# EAGLE design hauptplatine_prot (EAGLE 5.10)
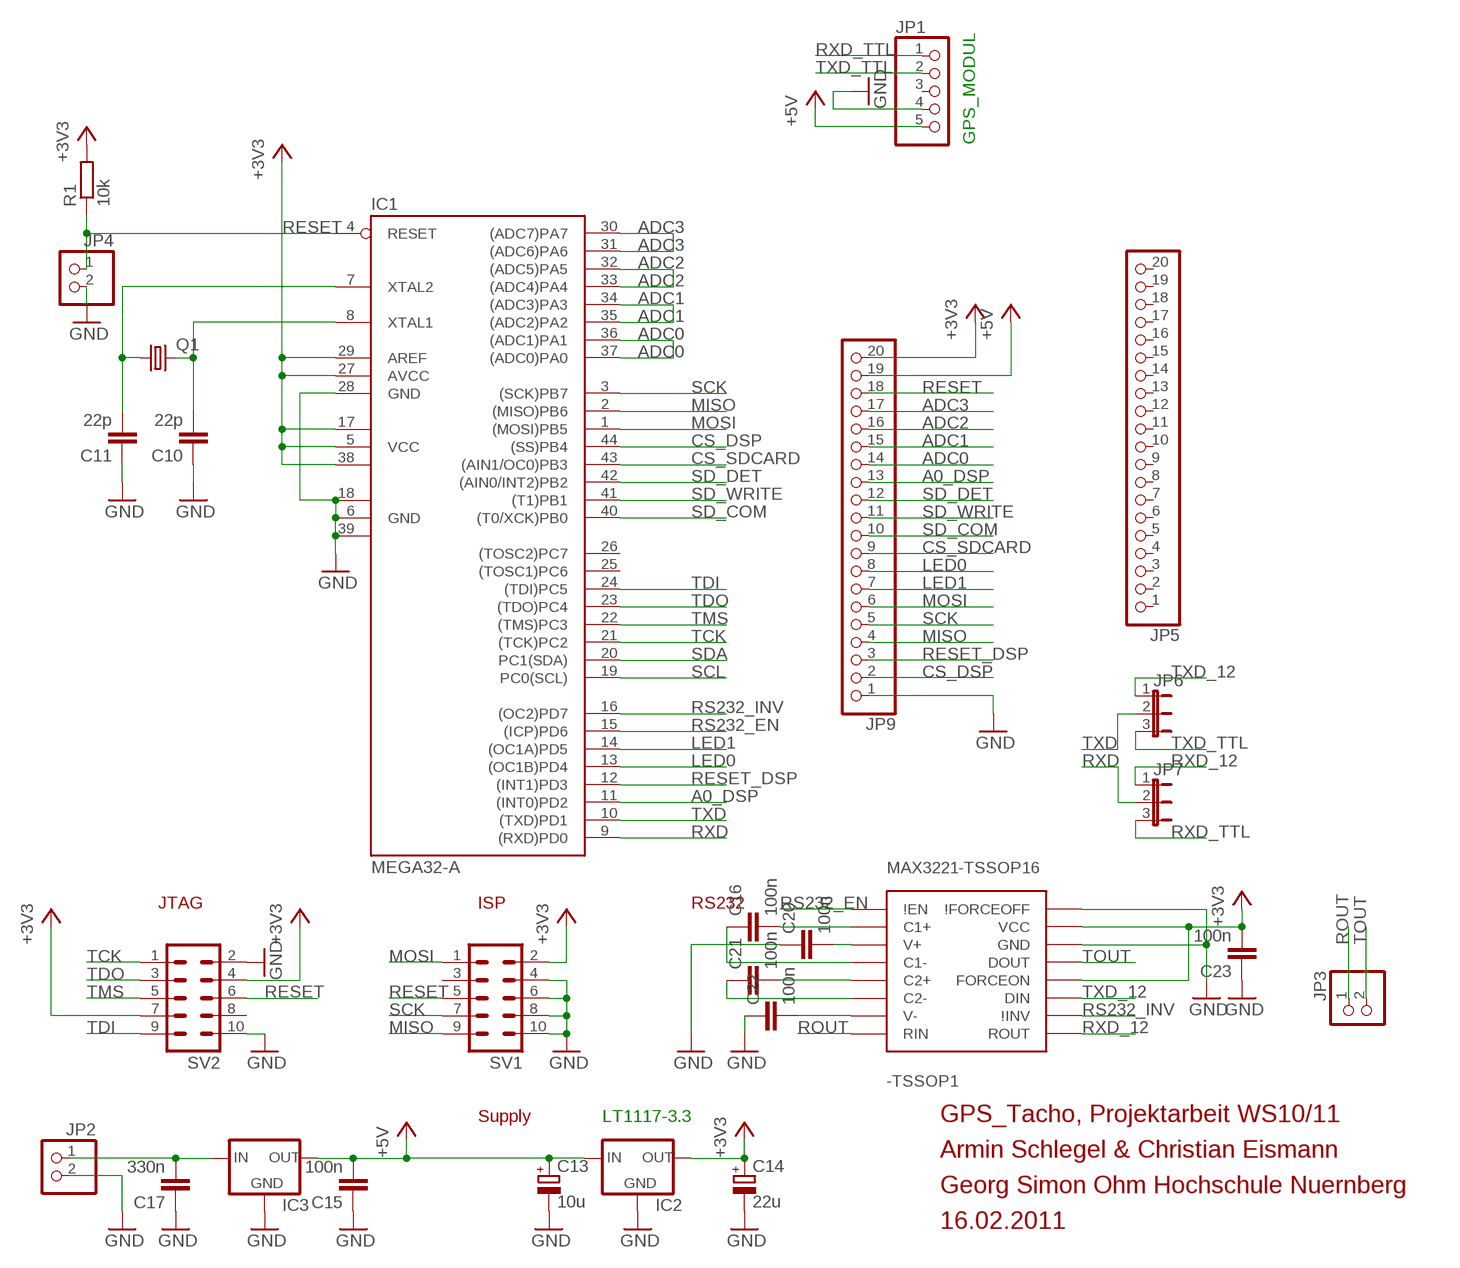
[diagram p0: schematic, sheet 1]

## Parts
-TSSOP1  MAX3221-TSSOP16  [TSSOP16]
C10  22p  C-EUC0805  [C0805]
C11  22p  C-EUC0805  [C0805]
C13  10u  CPOL-EUE1.8-4  [E1,8-4]
C14  22u  CPOL-EUE2.5-6  [E2,5-6]
C15  100n  C-EUC0805  [C0805]
C16  100n  C-EUC0805K  [C0805K]
C17  330n  C-EUC0805  [C0805]
C20  100n  C-EUC0805K  [C0805K]
C21  100n  C-EUC0805K  [C0805K]
C22  100n  C-EUC0805K  [C0805K]
C23  100n  C-EUC0805K  [C0805K]
IC1  MEGA32-A  [TQFP44]
IC2  LM1117  [SOT223]
IC3  78XXS  [78XXS]
JP1  PINHD-1X5_2.54-90°  [1X05/90]
JP2  PINHD-1X2/90  [1X02/90]
JP3  PINHD-1X2/90  [1X02/90]
JP4  PINHD-1X2/90  [1X02/90]
JP5  PINHD-1X20  [1X20]
JP6  JP2E  [JP2]
JP7  JP2E  [JP2]
JP9  PINHD-1X20  [1X20]
Q1  CRYSTALHC49UP  [HC49UP]
R1  10k  R-EU_R0805  [R0805]
SV1  ML10L  [ML10L]
SV2  ML10L  [ML10L]

## Nets
+3V3: -TSSOP1.12(FORCEON) -TSSOP1.15(VCC) C14.+ C23.2 IC1.5(VCC) IC1.17(VCC1) IC1.27(AVCC) IC1.29(AREF) IC1.38(VCC2) IC2.2(OUT) JP9.20 R1.2 SV1.2 SV2.4 SV2.7
+5V: C13.+ C15.2 IC2.3(IN) IC3.OUT JP1.5 JP9.19
A0_DSP: IC1.11((INT0)PD2) JP9.13
ADC0: IC1.36((ADC1)PA1) IC1.37((ADC0)PA0) JP9.14
ADC1: IC1.34((ADC3)PA3) IC1.35((ADC2)PA2) JP9.15
ADC2: IC1.32((ADC5)PA5) IC1.33((ADC4)PA4) JP9.16
ADC3: IC1.30((ADC7)PA7) IC1.31((ADC6)PA6) JP9.17
CS_DSP: IC1.44((SS)PB4) JP9.2
CS_SDCARD: IC1.43((AIN1/OC0)PB3) JP9.9
GND: -TSSOP1.14(GND) -TSSOP1.16(\!FORCEOFF) C10.1 C11.1 C13.- C14.- C15.1 C17.1 C20.1 C22.1 C23.1 IC1.6(GND) IC1.18(GND1) IC1.28(GND) IC1.39(GND2) IC2.1(GND) IC3.GND JP1.4 JP2.2 JP4.2 JP9.1 SV1.4 SV1.6 SV1.8 SV1.10 SV2.2 SV2.10
LED0: IC1.13((OC1B)PD4) JP9.8
LED1: IC1.14((OC1A)PD5) JP9.7
MISO: IC1.2((MISO)PB6) JP9.4 SV1.9
MOSI: IC1.1((MOSI)PB5) JP9.6 SV1.1
N$2: C10.2 IC1.8(XTAL1) Q1.2
N$15: C11.2 IC1.7(XTAL2) Q1.1
N$19: -TSSOP1.7(V-) C22.2
N$20: C17.2 IC3.IN JP2.1
N$21: -TSSOP1.3(V+) C20.2
N$23: -TSSOP1.2(C1+) C16.2
N$24: -TSSOP1.4(C1-) C16.1
N$25: -TSSOP1.5(C2+) C21.2
N$26: -TSSOP1.6(C2-) C21.1
RESET: IC1.4(RESET) JP4.1 JP9.18 R1.1 SV1.5 SV2.6
RESET_DSP: IC1.12((INT1)PD3) JP9.3
ROUT: -TSSOP1.8(RIN) JP3.1
RS232_EN: -TSSOP1.1(\!EN) IC1.15((ICP)PD6)
RS232_INV: -TSSOP1.10(\!INV) IC1.16((OC2)PD7)
RXD: IC1.9((RXD)PD0) JP7.2
RXD_12: -TSSOP1.9(ROUT) JP7.1
RXD_TTL: JP1.1 JP7.3
SCK: IC1.3((SCK)PB7) JP9.5 SV1.7
SCL: IC1.19(PC0(SCL))
SD_COM: IC1.40((T0/XCK)PB0) JP9.10
SD_DET: IC1.42((AIN0/INT2)PB2) JP9.12
SD_WRITE: IC1.41((T1)PB1) JP9.11
SDA: IC1.20(PC1(SDA))
TCK: IC1.21((TCK)PC2) SV2.1
TDI: IC1.24((TDI)PC5) SV2.9
TDO: IC1.23((TDO)PC4) SV2.3
TMS: IC1.22((TMS)PC3) SV2.5
TOUT: -TSSOP1.13(DOUT) JP3.2
TXD: IC1.10((TXD)PD1) JP6.2
TXD_12: -TSSOP1.11(DIN) JP6.1
TXD_TTL: JP1.2 JP6.3
Unconnected: IC1.25((TOSC1)PC6) IC1.26((TOSC2)PC7) JP1.3 JP5.1 JP5.2 JP5.3 JP5.4 JP5.5 JP5.6 JP5.7 JP5.8 JP5.9 JP5.10 JP5.11 JP5.12 JP5.13 JP5.14 JP5.15 JP5.16 JP5.17 JP5.18 JP5.19 JP5.20 SV1.3 SV2.8

## Notes on the sheet
- GPS_MODUL
- JTAG | ISP | RS232
- Supply | LT1117-3.3 | GPS_Tacho, Projektarbeit WS10/11
- Armin Schlegel & Christian Eismann
- Georg Simon Ohm Hochschule Nuernberg
- 16.02.2011

## Library data of the parts
-TSSOP1 = texas-msp:MAX3221
C10 C11 C15-C17 C20-C23 = rcl:C-EU: CAPACITOR, European symbol
C13 C14 = rcl:CPOL-EU: POLARIZED CAPACITOR, European symbol
IC1 = atmel:MEGA32: MICROCONTROLLER 32 Kbytes FLASH 2 Kbytes SRAM 1 Kbytes EEPROM USART 8-channel 10 bit ADC Source: www.atmel.com .. doc2503.pdf
IC2 = v-reg-2:LM1117
IC3 = v-reg:78XXS: VOLTAGE REGULATOR
JP1 = pinhead:PINHD-1X5: PIN HEADER
JP2-JP4 = pinhead:PINHD-1X2: PIN HEADER
JP5 JP9 = pinhead:PINHD-1X20: PIN HEADER
JP6 JP7 = jumper:JP2E: JUMPER
Q1 = crystal:CRYSTAL: CRYSTAL
R1 = rcl:R-EU_: RESISTOR, European symbol
SV1 SV2 = con-harting-ml:ML10: HARTING

## Board
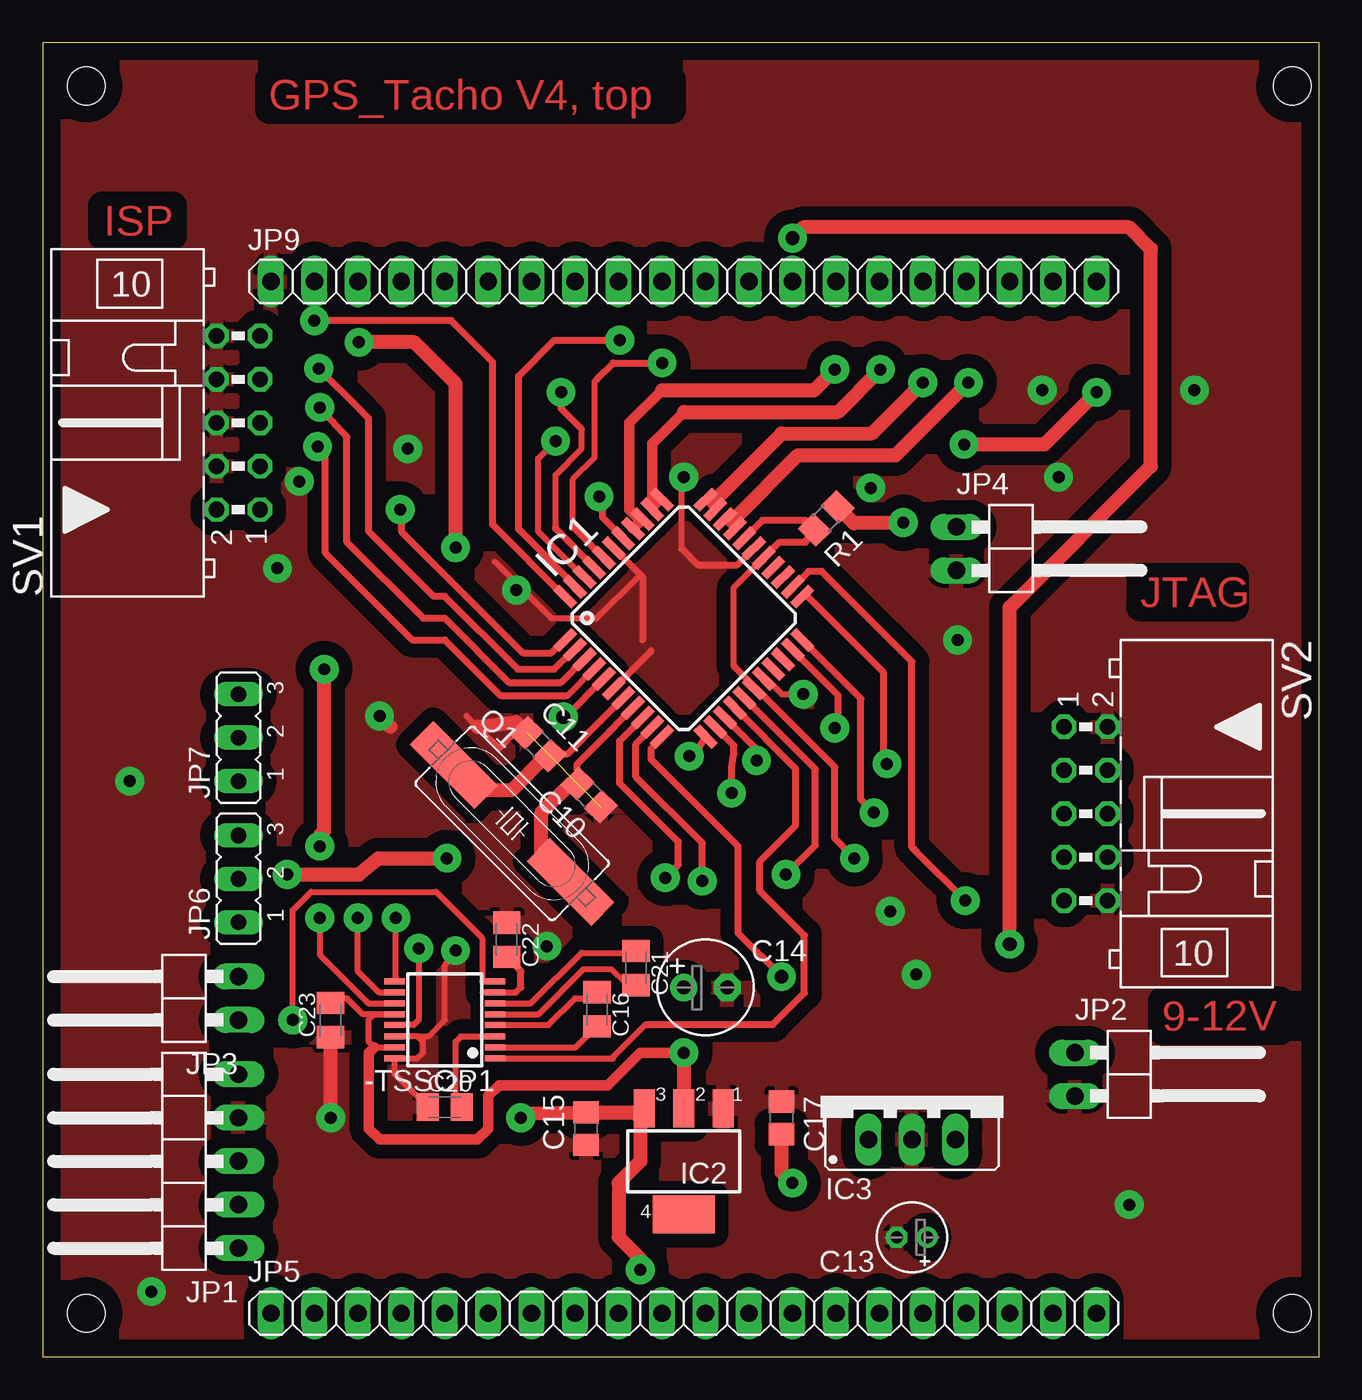
[diagram p1: board, top side]
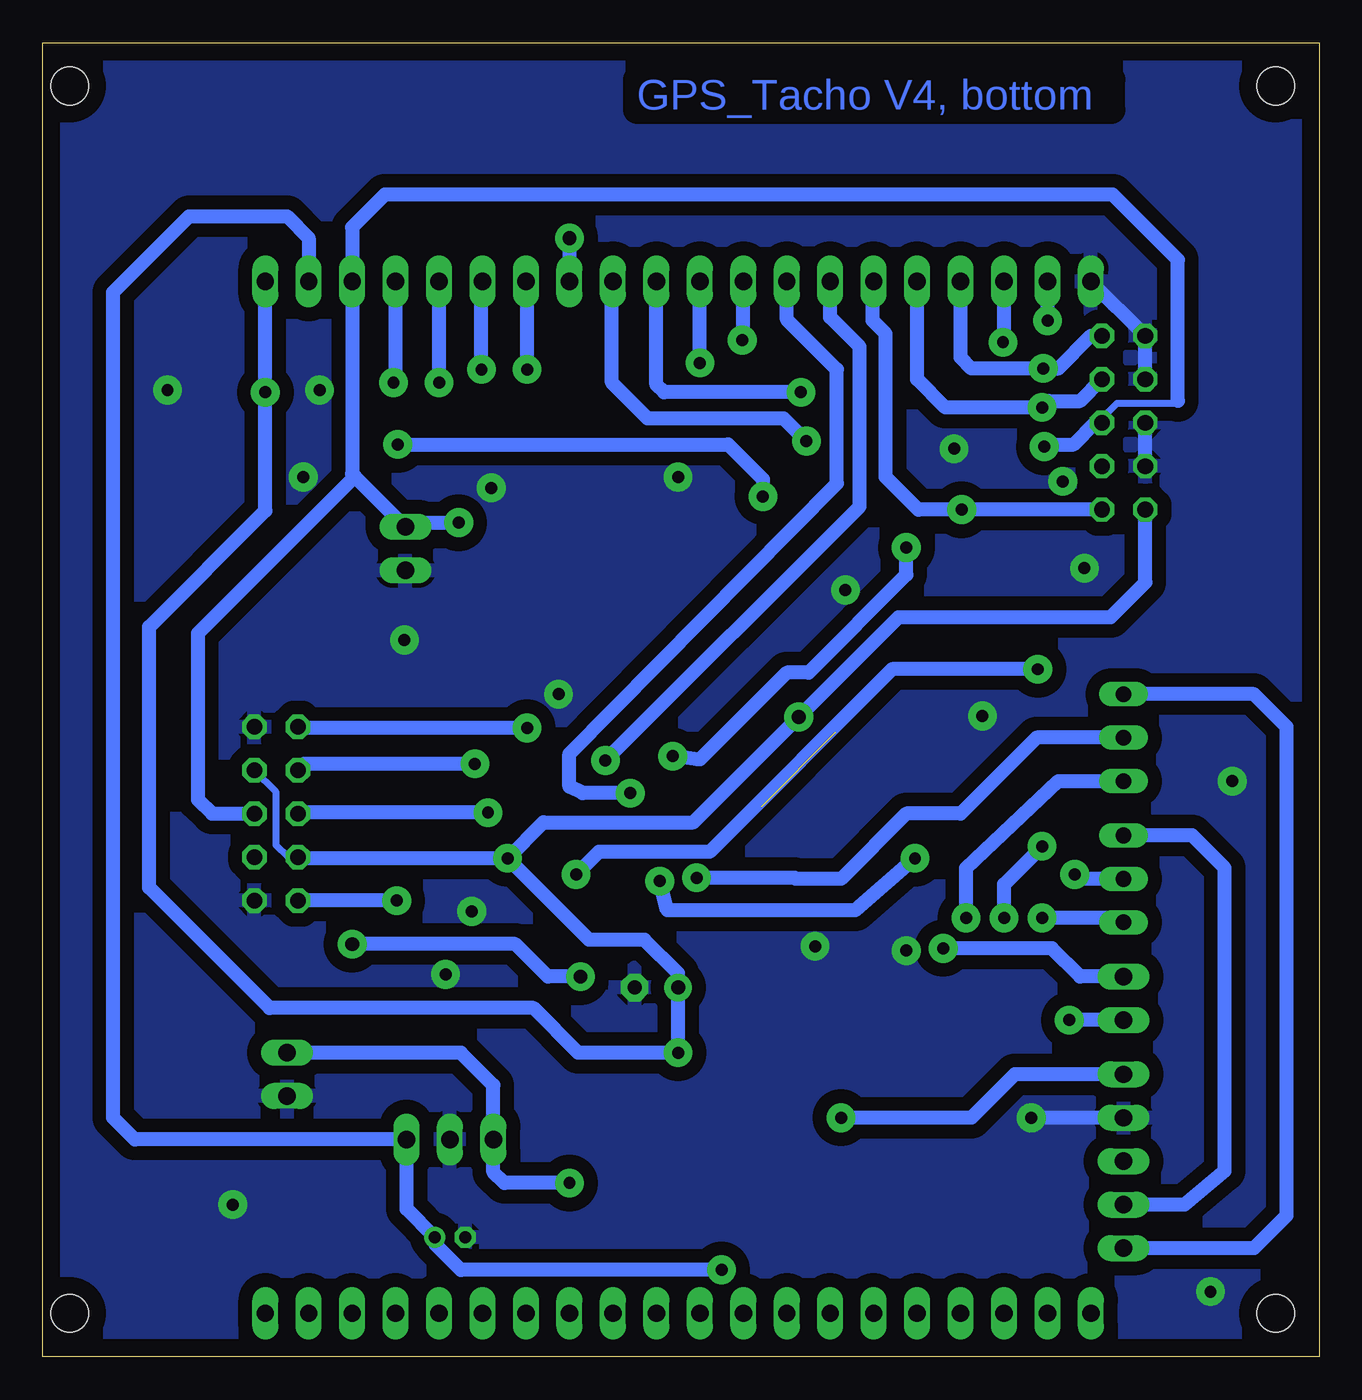
[diagram p2: board, bottom side, seen from below]

Size 74.6 x 76.83 mm. Coordinates in mm from the lower left corner, seen from the top.
Outline: 0,0 74.6,0 74.6,76.83 0,76.83 0,0
Copper layers (1*16): Top 0.035mm / dielectric 1.5mm / Bottom 0.035mm
Design rules "default": minimum track width 10mil, minimum drill 24mil, track to track 8mil, track to pad 8mil, pad to pad 8mil, via to via 8mil, smd to smd 8mil, copper to edge 40mil, drill to drill 8mil, minimum pad ring 10mil, minimum via ring 8mil, stop-mask expansion 4mil, vias tented up to drill 0mil, thermal gap 10mil
Holes 2.2 mm at 2.54,2.54 73.03,2.54 73.03,74.3 2.54,74.3

### Footprints (pad centres in the part's own frame; a part is rotated, then mirrored left to right if it is on the bottom)
TSSOP16 = smd 0.35 x 1.2: 1 -0.975,-2.925; 2 -0.325,-2.925; 3 0.325,-2.925; 4 0.975,-2.925; 5 1.605,-2.925; 6 2.245,-2.925; 7 2.885,-2.925; 8 3.525,-2.925; 9 3.535,2.925; 10 2.895,2.925; 11 2.255,2.925; 12 1.615,2.925; 13 0.975,2.925; 14 0.325,2.925; 15 -0.325,2.925; 16 -0.975,2.925
C0805 = smd 1.3 x 1.5: 1 -0.95,0; 2 0.95,0
E1,8-4 = drill 0.711 pad 1.168 round: + -0.889,0 | drill 0.711 pad 1.168 octagon: - 0.889,0
E2,5-6 = drill 0.813 pad 1.6 round: + -1.27,0 | drill 0.813 pad 1.6 octagon: - 1.27,0
C0805K = smd 1.3 x 1.6: 1 -1,0; 2 1,0
TQFP44 = smd 1.5 x 0.5: 1 -5.8,4; 2 -5.8,3.2; 3 -5.8,2.4; 4 -5.8,1.6; 5 -5.8,0.8; 6 -5.8,0; 7 -5.8,-0.8; 8 -5.8,-1.6; 9 -5.8,-2.4; 10 -5.8,-3.2; 11 -5.8,-4; 23 5.8,-4; 24 5.8,-3.2; 25 5.8,-2.4; 26 5.8,-1.6; 27 5.8,-0.8; 28 5.8,0; 29 5.8,0.8; 30 5.8,1.6; 31 5.8,2.4; 32 5.8,3.2; 33 5.8,4 | smd 0.5 x 1.5: 12 -4,-5.8; 13 -3.2,-5.8; 14 -2.4,-5.8; 15 -1.6,-5.8; 16 -0.8,-5.8; 17 0,-5.8; 18 0.8,-5.8; 19 1.6,-5.8; 20 2.4,-5.8; 21 3.2,-5.8; 22 4,-5.8; 34 4,5.8; 35 3.2,5.8; 36 2.4,5.8; 37 1.6,5.8; 38 0.8,5.8; 39 0,5.8; 40 -0.8,5.8; 41 -1.6,5.8; 42 -2.4,5.8; 43 -3.2,5.8; 44 -4,5.8
SOT223 = smd 1.219 x 2.235: 1 -2.311,-3.099; 2 0,-3.099; 3 2.311,-3.099 | smd 3.6 x 2.2: 4 0,3.099
78XXS = drill 1.016 long: GND 0,-2.54; IN -2.54,-2.54; OUT 2.54,-2.54
1X05/90 = drill 1.016 long: 1 -5.08,-3.81; 2 -2.54,-3.81; 3 0,-3.81; 4 2.54,-3.81; 5 5.08,-3.81
1X02/90 = drill 1.016 long: 1 -1.27,-3.81; 2 1.27,-3.81
1X20 = drill 1.016 long: 1 -24.13,0; 2 -21.59,0; 3 -19.05,0; 4 -16.51,0; 5 -13.97,0; 6 -11.43,0; 7 -8.89,0; 8 -6.35,0; 9 -3.81,0; 10 -1.27,0; 11 1.27,0; 12 3.81,0; 13 6.35,0; 14 8.89,0; 15 11.43,0; 16 13.97,0; 17 16.51,0; 18 19.05,0; 19 21.59,0; 20 24.13,0
JP2 = drill 0.914 long: 1 -2.54,0; 2 0,0; 3 2.54,0
HC49UP = smd 5.334 x 1.93: 1 -4.826,0; 2 4.826,0
R0805 = smd 1.3 x 1.5: 1 -0.95,0; 2 0.95,0
ML10L = drill 0.914 octagon: 1 -5.08,-1.27; 2 -5.08,1.27; 3 -2.54,-1.27; 4 -2.54,1.27; 5 0,-1.27; 6 0,1.27; 7 2.54,-1.27; 8 2.54,1.27; 9 5.08,-1.27; 10 5.08,1.27

### Placement (x,y rotation side)
-TSSOP1  23.5,18.41 90 top
C10  31.94,32.83 135 top
C11  28.96,35.81 315 top
C13  50.8,6.99 180 top
C14  38.73,21.59 0 top
C15  31.75,13.34 90 top
C16  32.38,20.32 270 top
C17  43.18,13.97 270 top
C20  23.5,14.61 0 top
C21  34.67,22.73 270 top
C22  27.11,24.38 270 top
C23  16.83,19.68 90 top
IC1  37.47,43.18 45 top
IC2  37.47,11.43 180 top
IC3  50.8,15.24 0 top
JP1  7.62,11.43 90 top
JP2  64.14,16.51 270 top
JP3  7.62,20.95 90 top
JP4  57.21,47.24 270 top
JP5  37.47,2.54 0 top
JP6  11.43,27.94 90 top
JP7  11.43,36.2 90 top
JP9  37.47,62.87 0 top
Q1  27.43,31.18 315 top
R1  45.78,49.02 225 top
SV1  11.43,54.61 90 top
SV2  60.96,31.75 270 top

### Tracks (layer width: path | path; a pad name or v marks a point on that pad's centre or on a via)
+3V3  (via drill 0.7 pad 1.68, 0.8 pad 1.68)
  Top 0.356: -TSSOP1.15 19.38,18.09 19.05,18.41 19.05,19.68 19.39,20.03 -TSSOP1.12 18.7,20.03 17.78,20.95 17.41,20.95 C23.2 | 40.39,40.39 40.39,44.97 IC1.27 | IC1.38
  Top 0.406: IC1.27 42.14,46.72 43.05,47.62 44.57,47.62 R1.2 44.57,48.9 42.04,48.9 IC1.29 | 41.69,39.08 IC1.17 | v47.43,29.15 46.29,30.29 46.29,34.48 41.69,39.08 | v32.51,50.29 32.7,50.1 32.7,49.09 IC1.38 | IC1.5 30.55,37.4 v30.42,37.4 | 41.69,39.08 40.39,40.39
  Top 0.61: v37.47,17.78 34.92,17.78 33.02,15.88 26.67,15.88 26.04,15.24 26.04,13.34 25.4,12.7 19.68,12.7 19.05,13.34 19.05,17.77 19.38,18.09
  Top 0.813: v37.47,17.78 IC2.2 | v53.85,53.34 58.55,53.34 v61.59,56.39
  Bottom 0.406: SV2.7 60.26,29.21 60.96,29.91 60.96,33.02 SV2.4
  Bottom 0.813: v47.43,29.15 59.63,29.15 SV2.7 | v47.43,29.15 42.67,24.38 39.43,24.38 37.47,22.42 C14.+ v37.47,17.78 43.31,17.78 45.91,20.38 61.34,20.38 68.39,27.43 68.39,42.67 61.59,49.47 v61.59,56.39 JP9.20 | SV1.2 10.16,45.28 12.19,43.24 24.57,43.24 v30.42,37.4 36.58,31.24 45.34,31.24 v47.43,29.15 | v32.51,50.29 32.51,51.31 34.54,53.34 v53.85,53.34
+5V  (via drill 0.7 pad 1.68)
  Top 0.813: 34.92,13.97 34.92,14.3 IC2.3 | 34.92,13.97 34.61,14.29 C15.2 28.13,14.22 v27.94,13.97 | v34.92,5.08 34.92,5.71 33.66,6.99 33.66,10.16 34.92,11.43 34.92,13.97
  Bottom 0.813: v34.92,5.08 50.16,5.08 51.69,6.6 C13.+ 53.34,8.64 IC3.OUT 69.22,12.7 70.48,13.97 70.48,62.23 66.04,66.67 60.33,66.67 59.05,65.41 JP9.19 | JP1.5 17.78,16.51 20.32,13.97 v27.94,13.97
A0_DSP  (via drill 0.8 pad 1.68)
  Top 0.406: IC1.11 36.19,36.19 35.56,35.56 35.56,34.92 40.64,29.84 40.64,24.77 v43.18,22.23
  Top 0.813: v43.81,65.41 44.45,66.04 63.5,66.04 64.77,64.77 64.77,52.07 56.52,43.81 v56.52,24.13
  Bottom 0.813: v43.81,65.41 JP9.13 | v43.18,22.23 45.09,22.23 46.99,24.13 v56.52,24.13
ADC0  (via drill 0.7 pad 1.68)
  Top 0.356: 35.03,48.98 35.03,49.04
  Top 0.406: IC1.36 35.03,48.98 35.03,48.95 | 35.03,49.04 34.78,49.04
  Top 0.61: IC1.37 35.03,48.95 | 34.78,49.04 34.29,49.53 34.29,54.61 36.2,56.52
  Top 0.813: 36.2,56.52 45.09,56.52 v46.29,57.72
  Bottom 0.813: v46.29,57.72 46.29,62.8 JP9.14
ADC1  (via drill 0.7 pad 1.68)
  Top 0.406: IC1.34 IC1.35 | IC1.34 | IC1.34 35.62,50.11
  Top 0.61: 35.62,50.11 35.62,53.4 37.47,55.24
  Top 0.813: 37.47,55.24 46.48,55.24 v48.96,57.72
  Bottom 0.813: v48.96,57.72 48.96,62.8 JP9.15
ADC2  (via drill 0.7 pad 1.68)
  Top 0.406: IC1.33 IC1.32 39.3,50.1
  Top 0.813: 39.3,50.1 43.18,53.98 48.45,53.98 v51.44,56.96
  Bottom 0.813: v51.44,56.96 JP9.16
ADC3  (via drill 0.7 pad 1.68)
  Top 0.406: IC1.31 IC1.30 40.44,49.01 | v54.1,56.96 54.1,56.39
  Top 0.813: 40.44,49.01 44.13,52.7 49.85,52.7 v54.1,56.96
  Bottom 0.813: JP9.17 53.98,57.09 v54.1,56.96
CS_DSP  (via drill 0.7 pad 1.68)
  Top 0.406: IC1.44 30.48,44.45 26.29,48.64 26.29,58.17 23.88,60.58 v15.88,60.58
  Bottom 0.813: v15.88,60.58 JP9.2
CS_SDCARD  (via drill 0.7 pad 1.68)
  Top 0.406: v33.72,59.44 29.91,59.44 27.81,57.34 27.81,48.39 31.1,45.1 IC1.43
  Bottom 0.813: JP9.9 33.66,59.88 v33.72,59.44
GND  (via drill 0.7 pad 1.68)  (1 unrouted)
  Top 0.356: 21.9,18.74 -TSSOP1.14 | 21.9,18.74 22.23,18.41 22.23,17.78 21.89,17.44 -TSSOP1.16 20.57,16.53 C20.1 | 21.9,18.74 22.55,18.74 23.5,19.68 23.5,22.86 v24.13,23.75 | IC1.18 42.27,39.64 43.18,38.73 v44.45,38.73 | 35.05,45.59 34.8,45.59 32.38,43.18 29.72,43.18 26.42,46.48 | C11.1 27.6,36.49 26.67,35.56 25.4,36.83 24.77,37.47 | 37.34,47.24 37.34,50.8 v37.47,51.44
  Top 0.406: 35.05,41.91 35.05,45.59 IC1.39 | IC1.28 40.58,46.29 38.29,46.29 37.34,47.24 | IC1.6 35.56,41.27
  Top 0.813: v16.83,13.97 C23.1 | C11.1 27.65,37.12 25.4,36.83 | v19.68,37.47 20.32,36.83
  Bottom 0.813: JP1.4 v16.83,13.97 | SV1.8 SV1.10 JP9.1 | SV1.4 SV1.6
  other vias: 58.42,56.52 67.31,56.52 5.08,33.66 63.5,8.89 6.35,3.81 53.47,41.91 29.46,24 21.34,53.09 27.69,44.83 59.37,51.44 48.39,50.8 14.99,51.18 13.72,46.1 49.53,26.04 51.05,22.35
  pour Bottom (isolate 0.813): 0,76.83 74.3,76.83 74.3,0 0,0
  pour Top (isolate 0.813): 0,76.83 74.3,76.83 74.3,0 0,0
LED0  (via drill 0.7 pad 1.68)
  Top 0.406: v40.26,32.96 40.26,34.48 40.39,35.24 40.39,35.73 IC1.13
  Bottom 0.813: JP9.8 31.11,60.64 28.19,57.72 28.19,51.05 43.81,35.24 43.81,33.34 43.05,32.96 v40.26,32.96
LED1  (via drill 0.7 pad 1.68)
  Top 0.406: v41.72,34.86 41.91,35.34 IC1.14
  Bottom 0.813: JP9.7 28.57,60.77 26.86,59.05 26.86,49.72 v41.72,34.86
MISO  (via drill 0.7 pad 1.68)
  Top 0.406: IC1.2 31.05,41.34 29.91,40.2 27.75,40.2 23.5,44.45 22.86,44.45 19.05,48.26 19.05,54.86 18.86,55.05 18.54,55.37 v16.13,57.78
  Bottom 0.813: SV1.9 13.34,59.69 15.24,57.78 v16.13,57.78 20.32,57.78 20.95,58.42 JP9.4
MOSI  (via drill 0.7 pad 1.68)
  Top 0.406: IC1.1 30.48,41.91 29.72,41.15 28.07,41.15 20.95,48.26 20.95,49.47 v20.89,49.53
  Bottom 0.813: JP9.6 26.1,62.8 26.1,60.58 25.34,59.82 25.34,51.44 23.43,49.53 v20.89,49.53 SV1.1
N$2
  Top 0.406: IC1.8 33.16,36.59 31.24,34.67 31.24,33.53 C10.2
  Top 0.813: C10.2 30.83,33.5 29.15,31.81 29.15,29.46 Q1.2
N$15
  Top 0.406: IC1.7 32.6,37.17 30.67,35.24 29.73,35.24 C11.2
  Top 0.813: C11.2 29.43,35.14 27.43,33.15 25.46,33.15 Q1.1
N$19
  Top 0.356: 25.69,21.3 -TSSOP1.7 27.65,21.3 27.94,21.59
  Top 0.406: 27.94,21.59 27.94,22.56 C22.2
N$20  (via drill 0.7 pad 1.68)
  Top 0.813: C17.2 43.18,10.79 v43.81,10.16
  Bottom 0.813: JP2.1 50.16,17.78 48.26,15.88 IC3.IN 48.26,10.79 47.62,10.16 v43.81,10.16
N$21
  Top 0.356: -TSSOP1.3 24.45,18.74 24.13,18.41 24.13,14.97 C20.2
N$23
  Top 0.356: -TSSOP1.2 31.16,18.09 C16.2
N$24
  Top 0.356: -TSSOP1.4 29.55,19.39 31.11,20.95 32.02,20.95 C16.1
N$25
  Top 0.356: -TSSOP1.5 28.97,20.02 31.62,22.67 33.21,22.67 34.04,21.84 34.56,21.84 C21.2
N$26
  Top 0.356: -TSSOP1.6 28.53,20.66 31.5,23.62 34.56,23.62 C21.1
RESET  (via drill 0.7 pad 1.68)
  Top 0.356: IC1.4 32.21,40.21 30.67,38.67 | v16.07,53.21 16.26,53.02
  Top 0.406: 30.67,38.67 26.73,38.67 23.5,41.91 21.59,41.91 16.51,46.99 16.51,52.77 v16.07,53.21
  Top 0.813: v50.29,48.77 50.27,48.74 47.41,48.74 R1.1
  Bottom 0.406: SV1.5 12.7,54.86 11.81,55.75 8.38,55.75 8.26,55.88
  Bottom 0.813: v50.29,48.77 53.15,48.77 JP4.1 56.36,51.47 | 56.36,51.47 56.52,51.63 JP9.18 56.52,66.04 54.61,67.94 12.06,67.94 8.26,64.14 8.26,55.88 | SV2.6 64.71,31.75 65.53,32.58 65.53,42.29 56.36,51.47 | SV1.5 13.08,54.61 14.35,53.34 15.94,53.34 v16.07,53.21
RESET_DSP  (via drill 0.7 pad 1.68)
  Top 0.406: v37.78,35.12 37.78,34.66 IC1.12
  Top 0.813: v18.48,59.31 21.72,59.31 24.13,56.9 v24.13,47.31
  Bottom 0.813: JP9.3 18.41,59.37 v18.48,59.31 | v24.13,47.31 24.13,45.72 29.84,40.01 31.11,40.01 36.2,34.92 36.32,34.92 v37.78,35.12
ROUT  (via drill 0.7 pad 1.68)
  Top 0.356: -TSSOP1.8 25.68,21.94 25.68,24.48 22.99,27.18 15.68,27.18 14.61,26.1 v14.61,19.68
  Bottom 0.813: JP3.1 v14.61,19.68
RS232_EN
  Top 0.356: -TSSOP1.1 33.31,17.44 33.31,17.5 35.24,19.43
  Top 0.406: 35.24,19.43 42.67,19.43 44.51,21.27 44.51,24.64 41.91,27.24 41.91,28.96 44.01,31.05 44.01,34.38 IC1.15
RS232_INV  (via drill 0.7 pad 1.68)
  Top 0.356: -TSSOP1.10 19.65,21.31 18.41,22.54 v18.41,25.65
  Top 0.406: v43.43,28.19 45.15,29.91 45.15,34.37 IC1.16
  Top 0.813: v16.19,29.84 16.19,30.48 16.45,30.73 v16.45,40.2
  Bottom 0.813: v18.41,25.65 18.41,27.62 v16.19,29.84 | v16.45,40.2 24.96,40.2 35.62,29.53 42.1,29.53 v43.43,28.19
RXD  (via drill 0.7 pad 1.68)
  Top 0.406: IC1.9 35.06,37.35 33.72,36.01 33.72,33.53 37.15,30.1 37.15,28.77 v36.39,28
  Bottom 0.813: v36.39,28 30.67,28 30.61,27.94 27.94,27.94 24.13,31.75 20.95,31.75 16.51,36.2 JP7.2
RXD_12  (via drill 0.7 pad 1.68)
  Top 0.356: v20.64,25.65 20.64,22.2 -TSSOP1.9
  Bottom 0.813: v20.64,25.65 20.64,28.57 15.24,33.66 JP7.1
RXD_TTL
  Bottom 0.813: JP1.1 3.81,6.35 1.91,8.26 1.91,36.83 3.81,38.73 JP7.3
SCK  (via drill 0.7 pad 1.68)
  Top 0.406: IC1.3 31.63,40.78 30.29,39.43 27.24,39.43 23.5,43.18 22.23,43.18 17.78,47.62 17.78,53.78 17.53,54.04 v16.19,55.5
  Bottom 0.813: 23.62,62.74 JP9.5 23.5,57.15 21.84,55.5 v16.19,55.5 15.81,55.88 13.97,55.88 SV1.7
SD_COM  (via drill 0.7 pad 1.68)
  Top 0.356: 32.38,57.15 32.26,57.02 32.26,52.58 30.99,51.31 30.99,48.51 32,47.5
  Top 0.406: v36.2,58.1 33.34,58.1 32.38,57.15 | 32.61,46.83 IC1.40 32.79,46.72 32,47.5
  Bottom 0.813: v36.2,58.1 JP9.10
SD_DET  (via drill 0.7 pad 1.68)
  Top 0.356: 31.63,45.58 28.96,48.26 28.96,52.51 v29.97,53.53
  Top 0.406: IC1.42 31.63,45.58
  Bottom 0.813: v29.97,53.53 31.3,54.86 39.24,54.86 41.34,56.96 41.34,62.8 JP9.12
SD_WRITE  (via drill 0.7 pad 1.68)
  Top 0.356: 29.97,48.51 29.97,51.56 31.5,53.09 31.5,54.23
  Top 0.406: v30.29,56.39 30.29,55.44 31.5,54.23 | IC1.41 29.97,48.41 29.97,48.51
  Bottom 0.813: JP9.11 38.73,56.83 38.29,56.39 v30.29,56.39
TCK  (via drill 0.7 pad 1.68)
  Top 0.406: IC1.21 43.83,41.33 46.48,38.67 46.48,36.96 v46.29,36.77
  Bottom 0.813: v46.29,36.77 59.63,36.77 SV2.1
TDI  (via drill 0.7 pad 1.68)
  Top 0.406: IC1.24 43.88,45.02 44.77,45.91 45.53,45.91 50.8,40.64 50.8,29.78 50.86,29.72 51.09,29.5 v53.91,26.67
  Bottom 0.813: v53.91,26.67 SV2.9
TDO  (via drill 0.7 pad 1.68)
  Top 0.406: IC1.23 44.7,44.45 49.15,40.01 49.15,34.86 v49.34,34.67
  Bottom 0.813: v49.34,34.67 59.31,34.67 SV2.3
TMS  (via drill 0.7 pad 1.68)
  Top 0.406: IC1.22 47.82,38.48 47.82,32.58 v48.58,31.81
  Bottom 0.813: v48.58,31.81 59.63,31.81 SV2.5
TOUT  (via drill 0.7 pad 1.68)
  Top 0.356: -TSSOP1.13 21.68,19.39 21.97,19.68 v21.97,23.88
  Bottom 0.813: v21.97,23.88 15.62,23.88 13.97,22.23 JP3.2
TXD  (via drill 0.7 pad 1.68)
  Top 0.406: IC1.10 35.63,36.77 34.67,35.81 34.67,33.91 38.54,30.04 v38.54,27.81
  Top 0.813: v23.62,29.15 19.62,29.15 18.48,28.19 v14.29,28.19
  Bottom 0.813: v38.54,27.81 38.1,26.1 27.11,26.1 v23.62,29.15 | JP6.2 14.03,27.94 v14.29,28.19
TXD_12  (via drill 0.7 pad 1.68)
  Top 0.356: -TSSOP1.11 19.02,20.67 16.19,23.5 v16.19,25.65
  Bottom 0.813: v16.19,25.65 11.87,25.65 JP6.1
TXD_TTL
  Bottom 0.813: JP1.2 7.87,8.89 5.52,10.86 5.52,28.57 7.43,30.48 JP6.3

### Text on the board
Top: GPS_Tacho V4, top | ISP | JTAG | 9-12V
Bottom: GPS_Tacho V4, bottom